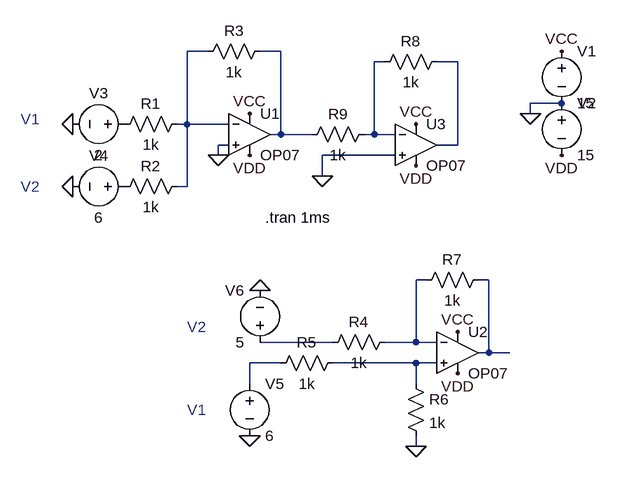
[diagram p0: schematic Adder subractor.asc]
Adder subractor.asc, the LTspice schematic file:
Version 4
SHEET 1 1672 692
WIRE -704 -192 -736 -192
WIRE -592 -192 -624 -192
WIRE -432 -176 -448 -176
WIRE -320 -176 -352 -176
WIRE -160 -112 -208 -112
WIRE -208 -96 -208 -112
WIRE -736 -80 -736 -192
WIRE -736 -80 -752 -80
WIRE -672 -80 -736 -80
WIRE -592 -64 -592 -192
WIRE -592 -64 -608 -64
WIRE -544 -64 -592 -64
WIRE -448 -64 -448 -176
WIRE -448 -64 -464 -64
WIRE -416 -64 -448 -64
WIRE -672 -48 -688 -48
WIRE -320 -48 -320 -176
WIRE -320 -48 -352 -48
WIRE -688 -32 -688 -48
WIRE -416 -32 -528 -32
WIRE -528 0 -528 -32
WIRE -736 16 -736 -80
WIRE -736 16 -752 16
WIRE -368 160 -384 160
WIRE -272 160 -288 160
WIRE -512 256 -624 256
WIRE -384 256 -384 160
WIRE -384 256 -432 256
WIRE -352 256 -384 256
WIRE -272 272 -272 160
WIRE -272 272 -288 272
WIRE -240 272 -272 272
WIRE -592 288 -640 288
WIRE -384 288 -512 288
WIRE -352 288 -384 288
WIRE -640 320 -640 288
WIRE -384 320 -384 288
WIRE -384 416 -384 400
FLAG -688 -32 0
FLAG -208 -96 0
FLAG -160 -192 VCC
FLAG -640 -96 VCC
FLAG -160 -32 VDD
FLAG -640 -32 VDD
FLAG -912 16 0
FLAG -912 -80 0
FLAG -384 416 0
FLAG -624 176 0
FLAG -640 400 0
FLAG -320 240 VCC
FLAG -320 304 VDD
FLAG -528 0 0
FLAG -384 -80 VCC
FLAG -384 -16 VDD
SYMBOL res -736 -96 R90
WINDOW 0 0 56 VBottom 2
WINDOW 3 32 56 VTop 2
SYMATTR InstName R1
SYMATTR Value 1k
SYMBOL res -736 0 R90
WINDOW 0 0 56 VBottom 2
WINDOW 3 32 56 VTop 2
SYMATTR InstName R2
SYMATTR Value 1k
SYMBOL voltage -160 -208 R0
WINDOW 123 0 0 Left 0
WINDOW 39 0 0 Left 0
SYMATTR InstName V1
SYMATTR Value 15
SYMBOL voltage -160 -128 R0
WINDOW 123 0 0 Left 0
WINDOW 39 0 0 Left 0
SYMATTR InstName V2
SYMATTR Value 15
SYMBOL voltage -816 -80 R90
WINDOW 0 -32 56 VBottom 2
WINDOW 3 32 56 VTop 2
WINDOW 123 0 0 Left 0
WINDOW 39 0 0 Left 0
SYMATTR InstName V3
SYMATTR Value 2
SYMBOL voltage -816 16 R90
WINDOW 0 -32 56 VBottom 2
WINDOW 3 32 56 VTop 2
WINDOW 123 0 0 Left 0
WINDOW 39 0 0 Left 0
SYMATTR InstName V4
SYMATTR Value 6
SYMBOL res -608 -208 R90
WINDOW 0 0 56 VBottom 2
WINDOW 3 32 56 VTop 2
SYMATTR InstName R3
SYMATTR Value 1k
SYMBOL res -416 240 R90
WINDOW 0 0 56 VBottom 2
WINDOW 3 32 56 VTop 2
SYMATTR InstName R4
SYMATTR Value 1k
SYMBOL res -496 272 R90
WINDOW 0 0 56 VBottom 2
WINDOW 3 32 56 VTop 2
SYMATTR InstName R5
SYMATTR Value 1k
SYMBOL res -400 304 R0
SYMATTR InstName R6
SYMATTR Value 1k
SYMBOL res -272 144 R90
WINDOW 0 0 56 VBottom 2
WINDOW 3 32 56 VTop 2
SYMATTR InstName R7
SYMATTR Value 1k
SYMBOL voltage -640 304 R0
WINDOW 123 0 0 Left 0
WINDOW 39 0 0 Left 0
SYMATTR InstName V5
SYMATTR Value 6
SYMBOL voltage -624 272 R180
WINDOW 0 24 96 Left 2
WINDOW 3 24 16 Left 2
WINDOW 123 0 0 Left 0
WINDOW 39 0 0 Left 0
SYMATTR InstName V6
SYMATTR Value 5
SYMBOL OpAmps\\OP07 -640 -128 R0
SYMATTR InstName U1
SYMBOL OpAmps\\OP07 -320 208 R0
SYMATTR InstName U2
SYMBOL OpAmps\\OP07 -384 -112 R0
SYMATTR InstName U3
SYMBOL res -336 -192 R90
WINDOW 0 0 56 VBottom 2
WINDOW 3 32 56 VTop 2
SYMATTR InstName R8
SYMATTR Value 1k
SYMBOL res -448 -80 R90
WINDOW 0 0 56 VBottom 2
WINDOW 3 32 56 VTop 2
SYMATTR InstName R9
SYMATTR Value 1k
TEXT -616 64 Left 2 !.tran 1ms
TEXT -992 -88 Left 2 ;V1
TEXT -736 360 Left 2 ;V1
TEXT -736 232 Left 2 ;V2
TEXT -992 16 Left 2 ;V2

The netlist it stands for:
* Adder subractor.asc
R1 N001 P001 1k
R2 N001 P002 1k
V1 VCC 0 15
V2 0 VDD 15
V3 P001 0 2
V4 P002 0 6
R3 N002 N001 1k
R4 N005 N007 1k
R5 N009 N008 1k
R6 N009 0 1k
R7 N006 N005 1k
V5 N008 0 6
V6 N007 0 5
XU1 0 N001 VCC VDD N002 LT1001  ; OP07, pins In+ In- V+ V- OUT
XU2 N009 N005 VCC VDD N006 LT1001  ; OP07, pins In+ In- V+ V- OUT
XU3 0 N003 VCC VDD N004 LT1001  ; OP07, pins In+ In- V+ V- OUT
R8 N004 N003 1k
R9 N003 N002 1k
.tran 1ms
* V1
* V1
* V2
* V2
.lib LTC.lib
.backanno
.end